# EAGLE design TPS60501 (EAGLE 6.5.0)
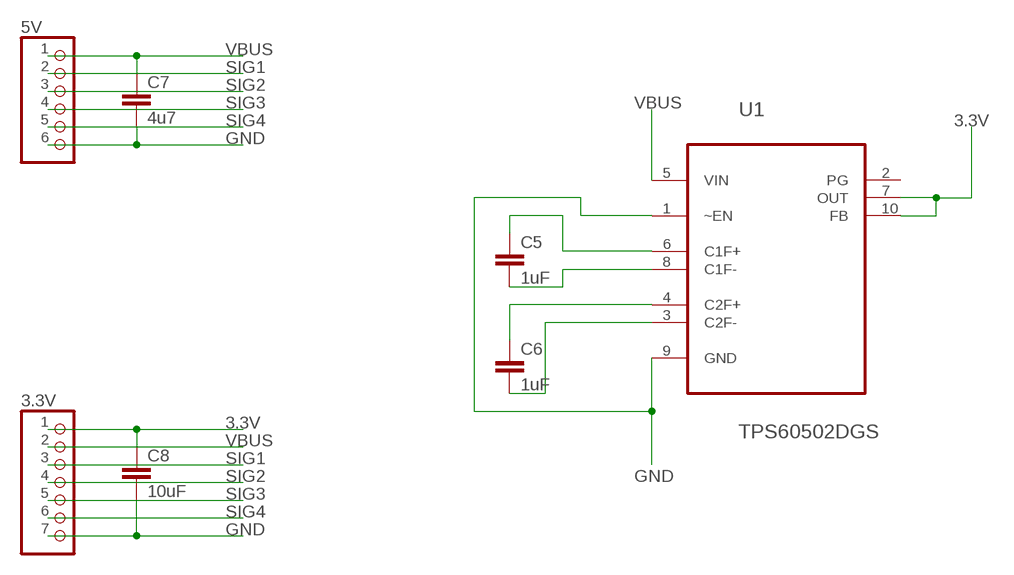
[diagram p0: schematic, sheet 1]

## Parts
3.3V  PINHD-1X7  [1X07]
5V  PINHD-1X6  [1X06]
C5  1uF  C-EU025-050X050  [C025-050X050]
C6  1uF  C-EU025-050X050  [C025-050X050]
C7  4u7  C-EU025-050X050  [C025-050X050]
C8  10uF  C-EU025-050X050  [C025-050X050]
U1  TPS60502DGS  [SOP50P490X110-10N]

## Nets
3.3V: 3.3V.1 C8.1 U1.7(OUT) U1.10(FB)
GND: 3.3V.7 5V.6 C7.2 C8.2 U1.1(~EN) U1.9(GND)
N$1: C5.1 U1.6(C1F+)
N$2: C5.2 U1.8(C1F-)
N$3: C6.1 U1.4(C2F+)
N$4: C6.2 U1.3(C2F-)
SIG1: 3.3V.3 5V.2
SIG2: 3.3V.4 5V.3
SIG3: 3.3V.5 5V.4
SIG4: 3.3V.6 5V.5
VBUS: 3.3V.2 5V.1 C7.1 U1.5(VIN)
Unconnected: U1.2(PG)

## Library data of the parts
3.3V = pinhead:PINHD-1X7: PIN HEADER
5V = pinhead:PINHD-1X6: PIN HEADER
C5-C8 = rcl:C-EU: CAPACITOR, European symbol
U1 = Texas Instruments_By_element14_Batch_1:TPS60502DGS: Step Down Charge Pump; MPN: TPS60502DGS; OC_FARNELL: 1461012; OC_NEWARK: 77C0638; PACKAGE: MSOP-10; SUPPLIER: Texas Instruments

## Board
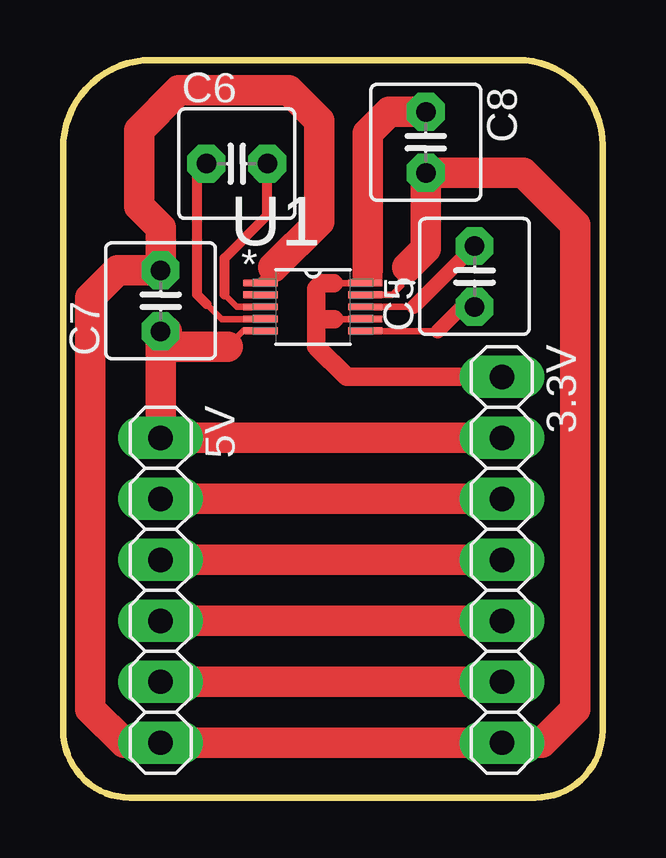
[diagram p1: board, top side]

Size 22.48 x 30.73 mm. Coordinates in mm from the lower left corner, seen from the top.
Outline: 22.48,2.79 22.48,27.18 arc90 18.92,30.73 3.68,30.73 arc90 0,27.05 0,2.79 arc90 2.79,0 19.69,0 arc90 22.48,2.79
Copper layers (1*16): Top 0.035mm / dielectric 1.5mm / Bottom 0.035mm
Design rules "SparkFun-2-layer *": minimum track width 7mil, minimum drill 15mil, track to track 8mil, track to pad 8mil, pad to pad 8mil, via to via 8mil, smd to smd 8mil, copper to edge 8mil, drill to drill 8mil, minimum pad ring 15mil, minimum via ring 10mil, stop-mask expansion 4mil, vias tented up to drill 20mil, thermal gap 10mil

### Footprints (pad centres in the part's own frame; a part is rotated, then mirrored left to right if it is on the bottom)
1X07 = drill 1.016 long: 1 -7.62,0; 2 -5.08,0; 3 -2.54,0; 4 0,0; 5 2.54,0; 6 5.08,0; 7 7.62,0
1X06 = drill 1.016 long: 1 -6.35,0; 2 -3.81,0; 3 -1.27,0; 4 1.27,0; 5 3.81,0; 6 6.35,0
C025-050X050 = drill 0.813 octagon: 1 -1.27,0; 2 1.27,0
SOP50P490X110-10N = smd 1.422 x 0.279: 1 -2.184,0.991; 2 -2.184,0.508; 3 -2.184,0; 4 -2.184,-0.508; 5 -2.184,-0.991; 6 2.184,-0.991; 7 2.184,-0.508; 8 2.184,0; 9 2.184,0.508; 10 2.184,0.991

### Placement (x,y rotation side)
3.3V  18.29,9.91 270 top
5V  4.06,8.64 270 top
C5  17.14,21.72 90 top
C6  7.24,26.42 0 top
C7  4.06,20.7 90 top
C8  15.11,27.3 270 top
U1  10.41,20.45 0 top

### Tracks (layer width: path | path; a pad name or v marks a point on that pad's centre or on a via)
3.3V
  Top 0.279: 11.28,21.44 U1.10 12.7,21.54 12.7,22.61 | U1.7 11.3,19.94
  Top 0.762: 3.3V.1 11.81,17.53 10.54,18.8 10.54,19.94 | 10.54,19.94 10.54,21.21 10.77,21.44 11.28,21.44 | 11.3,19.94 10.54,19.94
  Top 1.27: 12.7,22.61 12.7,27.69 13.59,28.57 C8.1
GND
  Top 0.279: 14.35,22.1 14.1,21.84 14.1,21.34 13.72,20.95 U1.9 | U1.1 8.23,21.57 8.76,22.1
  Top 1.27: 14.35,22.1 15.11,22.86 C8.2 19.18,26.04 21.34,23.88 21.34,3.68 19.94,2.29 3.3V.7 5V.6 2.54,2.29 1.14,3.68 1.14,20.83 2.29,21.97 C7.2 4.06,23.75 3.17,24.64 3.17,27.81 4.83,29.46 9.4,29.46 10.67,28.19 10.67,24 8.76,22.1
N$1
  Top 0.279: U1.6 12.62,19.43 15.62,19.43
  Top 0.61: 15.62,19.43 16.64,20.45 C5.1
N$2
  Top 0.279: U1.8 14.6,20.45
  Top 0.61: 14.6,20.45 C5.2
N$3
  Top 0.279: 5.97,20.57 6.6,19.94 U1.4
  Top 0.406: 5.97,20.57 5.59,20.95 5.59,26.04 C6.1
N$4
  Top 0.279: U1.3 7.24,20.45 6.73,20.95
  Top 0.406: 6.73,20.95 6.73,22.48 8.51,24.26 C6.2
N$5
  Top 1.27: 12.7,22.48 12.7,21.97
N$6
  Top 0.203: 13.21,21.46 13.21,22.23
N$7
  Top 0.254: 12.19,21.46 12.19,22.73
SIG1
  Top 1.27: 3.3V.3 5V.2
SIG2
  Top 1.27: 5V.3 3.3V.4
SIG3
  Top 1.27: 5V.4 3.3V.5
SIG4
  Top 1.27: 3.3V.6 5V.5
VBUS
  Top 0.279: 4.09,19.46 C7.1 | U1.5 7.52,19.46 6.86,18.8
  Top 1.27: 3.3V.2 5V.1 4.06,18.92 | 4.06,18.92 C7.1 4.32,19.43 | 6.86,18.8 4.19,18.8 4.06,18.92